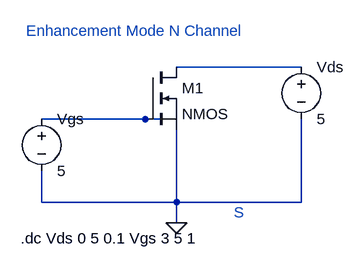
[diagram p0: schematic N-(E)Mosfet.asc]
N-(E)Mosfet.asc, the LTspice schematic file:
Version 4
SHEET 1 880 680
WIRE 528 128 336 128
WIRE 288 208 128 208
WIRE 320 208 288 208
WIRE 128 336 128 288
WIRE 336 336 336 224
WIRE 336 336 128 336
WIRE 528 336 528 208
WIRE 528 336 336 336
WIRE 336 368 336 336
FLAG 336 368 0
SYMBOL nmos 288 128 R0
SYMATTR InstName M1
SYMBOL voltage 128 192 R0
WINDOW 123 0 0 Left 0
WINDOW 39 0 0 Left 0
SYMATTR InstName Vgs
SYMATTR Value 5
SYMBOL voltage 528 112 R0
WINDOW 123 0 0 Left 0
WINDOW 39 0 0 Left 0
SYMATTR InstName Vds
SYMATTR Value 5
TEXT 96 392 Left 2 !.dc Vds 0 5 0.1 Vgs 3 5 1
TEXT 432 336 Top 2 ;S
TEXT 104 72 Left 2 ;Enhancement Mode N Channel

The netlist it stands for:
* N-(E)Mosfet.asc
M1 N001 N002 0 0 NMOS
Vgs N002 0 5
Vds N001 0 5
.model NMOS NMOS
.model PMOS PMOS
.lib standard.mos
.dc Vds 0 5 0.1 Vgs 3 5 1
* S
* Enhancement Mode N Channel
.backanno
.end